# EAGLE design LED Cube (EAGLE 6.4)
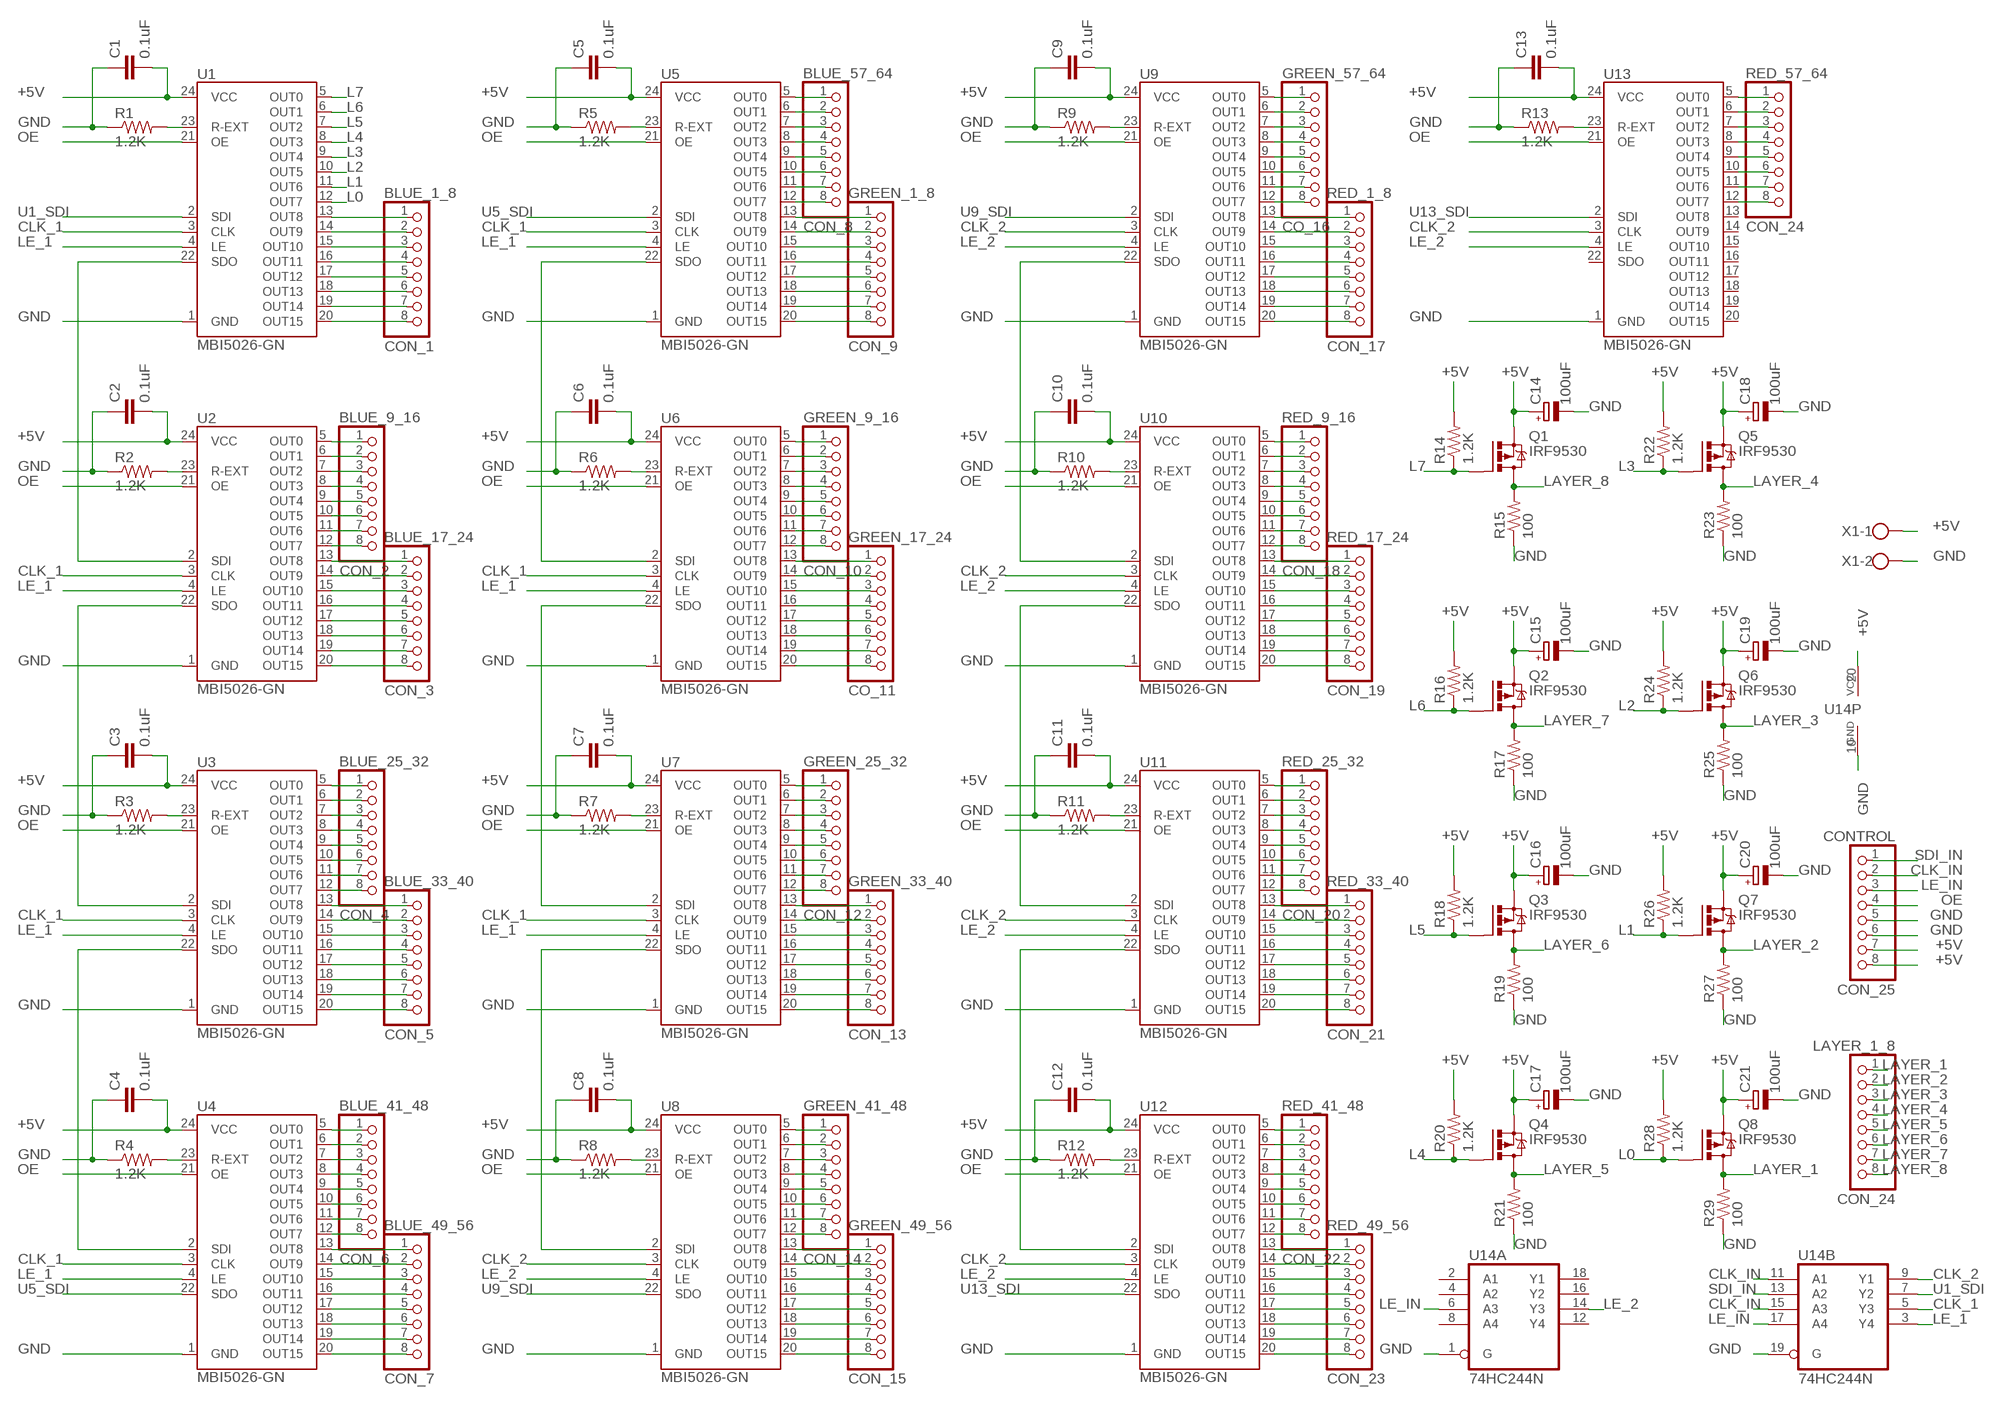
[diagram p0: schematic, sheet 1]

## Parts
BLUE_1_8  CON_1  PINHD-1X8BIG  [1X08-BIG]
BLUE_9_16  CON_2  PINHD-1X8BIG  [1X08-BIG]
BLUE_17_24  CON_3  PINHD-1X8BIG  [1X08-BIG]
BLUE_25_32  CON_4  PINHD-1X8BIG  [1X08-BIG]
BLUE_33_40  CON_5  PINHD-1X8BIG  [1X08-BIG]
BLUE_41_48  CON_6  PINHD-1X8BIG  [1X08-BIG]
BLUE_49_56  CON_7  PINHD-1X8BIG  [1X08-BIG]
BLUE_57_64  CON_8  PINHD-1X8BIG  [1X08-BIG]
C1  0.1uF  C2,5-3  [C2.5-3]
C2  0.1uF  C2,5-3  [C2.5-3]
C3  0.1uF  C2,5-3  [C2.5-3]
C4  0.1uF  C2,5-3  [C2.5-3]
C5  0.1uF  C2,5-3  [C2.5-3]
C6  0.1uF  C2,5-3  [C2.5-3]
C7  0.1uF  C2,5-3  [C2.5-3]
C8  0.1uF  C2,5-3  [C2.5-3]
C9  0.1uF  C2,5-3  [C2.5-3]
C10  0.1uF  C2,5-3  [C2.5-3]
C11  0.1uF  C2,5-3  [C2.5-3]
C12  0.1uF  C2,5-3  [C2.5-3]
C13  0.1uF  C2,5-3  [C2.5-3]
C14  100uF  CPOL-EUE5-6  [E5-6]
C15  100uF  CPOL-EUE5-6  [E5-6]
C16  100uF  CPOL-EUE5-6  [E5-6]
C17  100uF  CPOL-EUE5-6  [E5-6]
C18  100uF  CPOL-EUE5-6  [E5-6]
C19  100uF  CPOL-EUE5-6  [E5-6]
C20  100uF  CPOL-EUE5-6  [E5-6]
C21  100uF  CPOL-EUE5-6  [E5-6]
CONTROL  CON_25  PINHD-1X8BIG  [1X08-BIG]
GREEN_1_8  CON_9  PINHD-1X8BIG  [1X08-BIG]
GREEN_9_16  CON_10  PINHD-1X8BIG  [1X08-BIG]
GREEN_17_24  CO_11  PINHD-1X8BIG  [1X08-BIG]
GREEN_25_32  CON_12  PINHD-1X8BIG  [1X08-BIG]
GREEN_33_40  CON_13  PINHD-1X8BIG  [1X08-BIG]
GREEN_41_48  CON_14  PINHD-1X8BIG  [1X08-BIG]
GREEN_49_56  CON_15  PINHD-1X8BIG  [1X08-BIG]
GREEN_57_64  CO_16  PINHD-1X8BIG  [1X08-BIG]
LAYER_1_8  CON_24  PINHD-1X8BIG  [1X08-BIG]
Q1  IRF9530  [TO220BV]
Q2  IRF9530  [TO220BV]
Q3  IRF9530  [TO220BV]
Q4  IRF9530  [TO220BV]
Q5  IRF9530  [TO220BV]
Q6  IRF9530  [TO220BV]
Q7  IRF9530  [TO220BV]
Q8  IRF9530  [TO220BV]
R1  1.2K  R-US_0207/15  [0207/15]
R2  1.2K  R-US_0207/15  [0207/15]
R3  1.2K  R-US_0207/15  [0207/15]
R4  1.2K  R-US_0207/15  [0207/15]
R5  1.2K  R-US_0207/15  [0207/15]
R6  1.2K  R-US_0207/15  [0207/15]
R7  1.2K  R-US_0207/15  [0207/15]
R8  1.2K  R-US_0207/15  [0207/15]
R9  1.2K  R-US_0207/15  [0207/15]
R10  1.2K  R-US_0207/15  [0207/15]
R11  1.2K  R-US_0207/15  [0207/15]
R12  1.2K  R-US_0207/15  [0207/15]
R13  1.2K  R-US_0207/15  [0207/15]
R14  1.2K  R-US_0207/15  [0207/15]
R15  100  R-US_0207/15  [0207/15]
R16  1.2K  R-US_0207/15  [0207/15]
R17  100  R-US_0207/15  [0207/15]
R18  1.2K  R-US_0207/15  [0207/15]
R19  100  R-US_0207/15  [0207/15]
R20  1.2K  R-US_0207/15  [0207/15]
R21  100  R-US_0207/15  [0207/15]
R22  1.2K  R-US_0207/15  [0207/15]
R23  100  R-US_0207/15  [0207/15]
R24  1.2K  R-US_0207/15  [0207/15]
R25  100  R-US_0207/15  [0207/15]
R26  1.2K  R-US_0207/15  [0207/15]
R27  100  R-US_0207/15  [0207/15]
R28  1.2K  R-US_0207/15  [0207/15]
R29  100  R-US_0207/15  [0207/15]
RED_1_8  CON_17  PINHD-1X8BIG  [1X08-BIG]
RED_9_16  CON_18  PINHD-1X8BIG  [1X08-BIG]
RED_17_24  CON_19  PINHD-1X8BIG  [1X08-BIG]
RED_25_32  CON_20  PINHD-1X8BIG  [1X08-BIG]
RED_33_40  CON_21  PINHD-1X8BIG  [1X08-BIG]
RED_41_48  CON_22  PINHD-1X8BIG  [1X08-BIG]
RED_49_56  CON_23  PINHD-1X8BIG  [1X08-BIG]
RED_57_64  CON_24  PINHD-1X8BIG  [1X08-BIG]
U1  MBI5026-GN  [DIL24-3]
U2  MBI5026-GN  [DIL24-3]
U3  MBI5026-GN  [DIL24-3]
U4  MBI5026-GN  [DIL24-3]
U5  MBI5026-GN  [DIL24-3]
U6  MBI5026-GN  [DIL24-3]
U7  MBI5026-GN  [DIL24-3]
U8  MBI5026-GN  [DIL24-3]
U9  MBI5026-GN  [DIL24-3]
U10  MBI5026-GN  [DIL24-3]
U11  MBI5026-GN  [DIL24-3]
U12  MBI5026-GN  [DIL24-3]
U13  MBI5026-GN  [DIL24-3]
U14  74HC244N  [DIL20]
X1  W237-102  [W237-102]

## Nets
+5V: C1.2 C2.2 C3.2 C4.2 C5.2 C6.2 C7.2 C8.2 C9.2 C10.2 C11.2 C12.2 C13.2 C14.+ C15.+ C16.+ C17.+ C18.+ C19.+ C20.+ C21.+ CONTROL.7 CONTROL.8 Q1.S Q2.S Q3.S Q4.S Q5.S Q6.S Q7.S Q8.S R14.2 R16.2 R18.2 R20.2 R22.2 R24.2 R26.2 R28.2 U1.24(VCC) U2.24(VCC) U3.24(VCC) U4.24(VCC) U5.24(VCC) U6.24(VCC) U7.24(VCC) U8.24(VCC) U9.24(VCC) U10.24(VCC) U11.24(VCC) U12.24(VCC) U13.24(VCC) U14.20(P:VCC) X1.1
CLK_1: U1.3(CLK) U2.3(CLK) U3.3(CLK) U4.3(CLK) U5.3(CLK) U6.3(CLK) U7.3(CLK) U14.5(B:Y3)
CLK_2: U8.3(CLK) U9.3(CLK) U10.3(CLK) U11.3(CLK) U12.3(CLK) U13.3(CLK) U14.9(B:Y1)
CLK_IN: CONTROL.2 U14.11(B:A1) U14.15(B:A3)
GND: C1.1 C2.1 C3.1 C4.1 C5.1 C6.1 C7.1 C8.1 C9.1 C10.1 C11.1 C12.1 C13.1 C14.- C15.- C16.- C17.- C18.- C19.- C20.- C21.- CONTROL.5 CONTROL.6 R1.1 R2.1 R3.1 R4.1 R5.1 R6.1 R7.1 R8.1 R9.1 R10.1 R11.1 R12.1 R13.1 R15.1 R17.1 R19.1 R21.1 R23.1 R25.1 R27.1 R29.1 U1.1(GND) U2.1(GND) U3.1(GND) U4.1(GND) U5.1(GND) U6.1(GND) U7.1(GND) U8.1(GND) U9.1(GND) U10.1(GND) U11.1(GND) U12.1(GND) U13.1(GND) U14.1(A:G) U14.10(P:GND) U14.19(B:G) X1.2
L0: Q8.G R28.1 U1.12(OUT7)
L1: Q7.G R26.1 U1.11(OUT6)
L2: Q6.G R24.1 U1.10(OUT5)
L3: Q5.G R22.1 U1.9(OUT4)
L4: Q4.G R20.1 U1.8(OUT3)
L5: Q3.G R18.1 U1.7(OUT2)
L6: Q2.G R16.1 U1.6(OUT1)
L7: Q1.G R14.1 U1.5(OUT0)
LAYER_1: LAYER_1_8.1 Q8.D R29.2
LAYER_2: LAYER_1_8.2 Q7.D R27.2
LAYER_3: LAYER_1_8.3 Q6.D R25.2
LAYER_4: LAYER_1_8.4 Q5.D R23.2
LAYER_5: LAYER_1_8.5 Q4.D R21.2
LAYER_6: LAYER_1_8.6 Q3.D R19.2
LAYER_7: LAYER_1_8.7 Q2.D R17.2
LAYER_8: LAYER_1_8.8 Q1.D R15.2
LE_1: U1.4(LE) U2.4(LE) U3.4(LE) U4.4(LE) U5.4(LE) U6.4(LE) U7.4(LE) U14.3(B:Y4)
LE_2: U8.4(LE) U9.4(LE) U10.4(LE) U11.4(LE) U12.4(LE) U13.4(LE) U14.14(A:Y3)
LE_IN: CONTROL.3 U14.6(A:A3) U14.17(B:A4)
N$1: U1.22(SDO) U2.2(SDI)
N$2: BLUE_1_8.1 U1.13(OUT8)
N$3: BLUE_1_8.2 U1.14(OUT9)
N$4: BLUE_1_8.3 U1.15(OUT10)
N$5: R2.2 U2.23(R-EXT)
N$6: U2.22(SDO) U3.2(SDI)
N$7: BLUE_1_8.4 U1.16(OUT11)
N$8: BLUE_1_8.5 U1.17(OUT12)
N$9: BLUE_1_8.6 U1.18(OUT13)
N$10: R3.2 U3.23(R-EXT)
N$11: U3.22(SDO) U4.2(SDI)
N$12: BLUE_1_8.7 U1.19(OUT14)
N$13: BLUE_1_8.8 U1.20(OUT15)
N$14: R4.2 U4.23(R-EXT)
N$15: BLUE_9_16.1 U2.5(OUT0)
N$16: BLUE_9_16.2 U2.6(OUT1)
N$17: BLUE_9_16.3 U2.7(OUT2)
N$18: R1.2 U1.23(R-EXT)
N$19: BLUE_9_16.4 U2.8(OUT3)
N$20: BLUE_9_16.5 U2.9(OUT4)
N$21: R5.2 U5.23(R-EXT)
N$22: U5.22(SDO) U6.2(SDI)
N$23: BLUE_9_16.6 U2.10(OUT5)
N$24: BLUE_9_16.7 U2.11(OUT6)
N$25: R6.2 U6.23(R-EXT)
N$26: U6.22(SDO) U7.2(SDI)
N$27: BLUE_9_16.8 U2.12(OUT7)
N$28: BLUE_17_24.1 U2.13(OUT8)
N$29: BLUE_17_24.2 U2.14(OUT9)
N$30: BLUE_17_24.3 U2.15(OUT10)
N$31: R7.2 U7.23(R-EXT)
N$32: U7.22(SDO) U8.2(SDI)
N$33: BLUE_17_24.4 U2.16(OUT11)
N$34: BLUE_17_24.5 U2.17(OUT12)
N$35: R8.2 U8.23(R-EXT)
N$36: BLUE_17_24.6 U2.18(OUT13)
N$37: BLUE_17_24.7 U2.19(OUT14)
N$38: BLUE_17_24.8 U2.20(OUT15)
N$39: BLUE_25_32.1 U3.5(OUT0)
N$40: BLUE_25_32.2 U3.6(OUT1)
N$41: R9.2 U9.23(R-EXT)
N$42: U9.22(SDO) U10.2(SDI)
N$43: BLUE_25_32.3 U3.7(OUT2)
N$44: BLUE_25_32.4 U3.8(OUT3)
N$45: R10.2 U10.23(R-EXT)
N$46: U10.22(SDO) U11.2(SDI)
N$47: BLUE_25_32.5 U3.9(OUT4)
N$48: BLUE_25_32.6 U3.10(OUT5)
N$49: BLUE_25_32.7 U3.11(OUT6)
N$50: BLUE_25_32.8 U3.12(OUT7)
N$51: R11.2 U11.23(R-EXT)
N$52: U11.22(SDO) U12.2(SDI)
N$53: BLUE_33_40.1 U3.13(OUT8)
N$54: BLUE_33_40.2 U3.14(OUT9)
N$55: R12.2 U12.23(R-EXT)
N$56: BLUE_33_40.3 U3.15(OUT10)
N$57: BLUE_33_40.4 U3.16(OUT11)
N$58: BLUE_33_40.5 U3.17(OUT12)
N$59: BLUE_33_40.6 U3.18(OUT13)
N$60: BLUE_33_40.7 U3.19(OUT14)
N$61: BLUE_33_40.8 U3.20(OUT15)
N$62: R13.2 U13.23(R-EXT)
N$63: BLUE_41_48.1 U4.5(OUT0)
N$64: BLUE_41_48.2 U4.6(OUT1)
N$65: BLUE_41_48.3 U4.7(OUT2)
N$66: BLUE_41_48.4 U4.8(OUT3)
N$67: BLUE_41_48.5 U4.9(OUT4)
N$68: BLUE_41_48.6 U4.10(OUT5)
N$69: BLUE_41_48.7 U4.11(OUT6)
N$70: BLUE_41_48.8 U4.12(OUT7)
N$71: BLUE_49_56.1 U4.13(OUT8)
N$72: BLUE_49_56.2 U4.14(OUT9)
N$73: BLUE_49_56.3 U4.15(OUT10)
N$74: BLUE_49_56.4 U4.16(OUT11)
N$75: BLUE_49_56.5 U4.17(OUT12)
N$76: BLUE_49_56.6 U4.18(OUT13)
N$77: BLUE_49_56.7 U4.19(OUT14)
N$78: BLUE_49_56.8 U4.20(OUT15)
N$79: BLUE_57_64.1 U5.5(OUT0)
N$80: BLUE_57_64.2 U5.6(OUT1)
N$81: BLUE_57_64.3 U5.7(OUT2)
N$82: BLUE_57_64.4 U5.8(OUT3)
N$83: BLUE_57_64.5 U5.9(OUT4)
N$84: BLUE_57_64.6 U5.10(OUT5)
N$85: BLUE_57_64.7 U5.11(OUT6)
N$86: BLUE_57_64.8 U5.12(OUT7)
N$87: GREEN_1_8.1 U5.13(OUT8)
N$88: GREEN_1_8.2 U5.14(OUT9)
N$89: GREEN_1_8.3 U5.15(OUT10)
N$90: GREEN_1_8.4 U5.16(OUT11)
N$91: GREEN_1_8.5 U5.17(OUT12)
N$92: GREEN_1_8.6 U5.18(OUT13)
N$93: GREEN_1_8.7 U5.19(OUT14)
N$94: GREEN_1_8.8 U5.20(OUT15)
N$95: GREEN_9_16.1 U6.5(OUT0)
N$96: GREEN_9_16.2 U6.6(OUT1)
N$97: GREEN_9_16.3 U6.7(OUT2)
N$98: GREEN_9_16.4 U6.8(OUT3)
N$99: GREEN_9_16.5 U6.9(OUT4)
N$100: GREEN_9_16.6 U6.10(OUT5)
N$101: GREEN_9_16.7 U6.11(OUT6)
N$102: GREEN_9_16.8 U6.12(OUT7)
N$103: GREEN_17_24.1 U6.13(OUT8)
N$104: GREEN_17_24.2 U6.14(OUT9)
N$105: GREEN_17_24.3 U6.15(OUT10)
N$106: GREEN_17_24.4 U6.16(OUT11)
N$107: GREEN_17_24.5 U6.17(OUT12)
N$108: GREEN_17_24.6 U6.18(OUT13)
N$109: GREEN_17_24.7 U6.19(OUT14)
N$110: GREEN_17_24.8 U6.20(OUT15)
N$111: GREEN_25_32.1 U7.5(OUT0)
N$112: GREEN_25_32.2 U7.6(OUT1)
N$113: GREEN_25_32.3 U7.7(OUT2)
N$114: GREEN_25_32.4 U7.8(OUT3)
N$115: GREEN_25_32.5 U7.9(OUT4)
N$116: GREEN_25_32.6 U7.10(OUT5)
N$117: GREEN_25_32.7 U7.11(OUT6)
N$118: GREEN_25_32.8 U7.12(OUT7)
N$119: GREEN_33_40.1 U7.13(OUT8)
N$120: GREEN_33_40.2 U7.14(OUT9)
N$121: GREEN_33_40.3 U7.15(OUT10)
N$122: GREEN_33_40.4 U7.16(OUT11)
N$123: GREEN_33_40.5 U7.17(OUT12)
N$124: GREEN_33_40.6 U7.18(OUT13)
N$125: GREEN_33_40.7 U7.19(OUT14)
N$126: GREEN_33_40.8 U7.20(OUT15)
N$127: GREEN_41_48.1 U8.5(OUT0)
N$128: GREEN_41_48.2 U8.6(OUT1)
N$129: GREEN_41_48.3 U8.7(OUT2)
N$130: GREEN_41_48.4 U8.8(OUT3)
N$131: GREEN_41_48.5 U8.9(OUT4)
N$132: GREEN_41_48.6 U8.10(OUT5)
N$133: GREEN_41_48.7 U8.11(OUT6)
N$134: GREEN_41_48.8 U8.12(OUT7)
N$135: GREEN_49_56.1 U8.13(OUT8)
N$136: GREEN_49_56.2 U8.14(OUT9)
N$137: GREEN_49_56.3 U8.15(OUT10)
N$138: GREEN_49_56.4 U8.16(OUT11)
N$139: GREEN_49_56.5 U8.17(OUT12)
N$140: GREEN_49_56.6 U8.18(OUT13)
N$141: GREEN_49_56.7 U8.19(OUT14)
N$142: GREEN_49_56.8 U8.20(OUT15)
N$143: GREEN_57_64.1 U9.5(OUT0)
N$144: GREEN_57_64.2 U9.6(OUT1)
N$145: GREEN_57_64.3 U9.7(OUT2)
N$146: GREEN_57_64.4 U9.8(OUT3)
N$147: GREEN_57_64.5 U9.9(OUT4)
N$148: GREEN_57_64.6 U9.10(OUT5)
N$149: GREEN_57_64.7 U9.11(OUT6)
N$150: GREEN_57_64.8 U9.12(OUT7)
N$151: RED_1_8.1 U9.13(OUT8)
N$152: RED_1_8.2 U9.14(OUT9)
N$153: RED_1_8.3 U9.15(OUT10)
N$154: RED_1_8.4 U9.16(OUT11)
N$155: RED_1_8.5 U9.17(OUT12)
N$156: RED_1_8.6 U9.18(OUT13)
N$157: RED_1_8.7 U9.19(OUT14)
N$158: RED_1_8.8 U9.20(OUT15)
N$159: RED_9_16.1 U10.5(OUT0)
N$160: RED_9_16.2 U10.6(OUT1)
N$161: RED_9_16.3 U10.7(OUT2)
N$162: RED_9_16.4 U10.8(OUT3)
N$163: RED_9_16.5 U10.9(OUT4)
N$164: RED_9_16.6 U10.10(OUT5)
N$165: RED_9_16.7 U10.11(OUT6)
N$166: RED_9_16.8 U10.12(OUT7)
N$167: RED_17_24.1 U10.13(OUT8)
N$168: RED_17_24.2 U10.14(OUT9)
N$169: RED_17_24.3 U10.15(OUT10)
N$170: RED_17_24.4 U10.16(OUT11)
N$171: RED_17_24.5 U10.17(OUT12)
N$172: RED_17_24.6 U10.18(OUT13)
N$173: RED_17_24.7 U10.19(OUT14)
N$174: RED_17_24.8 U10.20(OUT15)
N$175: RED_25_32.1 U11.5(OUT0)
N$176: RED_25_32.2 U11.6(OUT1)
N$177: RED_25_32.3 U11.7(OUT2)
N$178: RED_25_32.4 U11.8(OUT3)
N$179: RED_25_32.5 U11.9(OUT4)
N$180: RED_25_32.6 U11.10(OUT5)
N$181: RED_25_32.7 U11.11(OUT6)
N$182: RED_25_32.8 U11.12(OUT7)
N$183: RED_33_40.1 U11.13(OUT8)
N$184: RED_33_40.2 U11.14(OUT9)
N$185: RED_33_40.3 U11.15(OUT10)
N$186: RED_33_40.4 U11.16(OUT11)
N$187: RED_33_40.5 U11.17(OUT12)
N$188: RED_33_40.6 U11.18(OUT13)
N$189: RED_33_40.7 U11.19(OUT14)
N$190: RED_33_40.8 U11.20(OUT15)
N$191: RED_41_48.1 U12.5(OUT0)
N$192: RED_41_48.2 U12.6(OUT1)
N$193: RED_41_48.3 U12.7(OUT2)
N$194: RED_41_48.4 U12.8(OUT3)
N$195: RED_41_48.5 U12.9(OUT4)
N$196: RED_41_48.6 U12.10(OUT5)
N$197: RED_41_48.7 U12.11(OUT6)
N$198: RED_41_48.8 U12.12(OUT7)
N$199: RED_49_56.1 U12.13(OUT8)
N$200: RED_49_56.2 U12.14(OUT9)
N$201: RED_49_56.3 U12.15(OUT10)
N$202: RED_49_56.4 U12.16(OUT11)
N$203: RED_49_56.5 U12.17(OUT12)
N$204: RED_49_56.6 U12.18(OUT13)
N$205: RED_49_56.7 U12.19(OUT14)
N$206: RED_49_56.8 U12.20(OUT15)
N$207: RED_57_64.1 U13.5(OUT0)
N$208: RED_57_64.2 U13.6(OUT1)
N$209: RED_57_64.3 U13.7(OUT2)
N$210: RED_57_64.4 U13.8(OUT3)
N$211: RED_57_64.5 U13.9(OUT4)
N$212: RED_57_64.6 U13.10(OUT5)
N$213: RED_57_64.7 U13.11(OUT6)
N$214: RED_57_64.8 U13.12(OUT7)
OE: CONTROL.4 U1.21(OE) U2.21(OE) U3.21(OE) U4.21(OE) U5.21(OE) U6.21(OE) U7.21(OE) U8.21(OE) U9.21(OE) U10.21(OE) U11.21(OE) U12.21(OE) U13.21(OE)
SDI_IN: CONTROL.1 U14.13(B:A2)
U1_SDI: U1.2(SDI) U14.7(B:Y2)
U5_SDI: U4.22(SDO) U5.2(SDI)
U9_SDI: U8.22(SDO) U9.2(SDI)
U13_SDI: U12.22(SDO) U13.2(SDI)
Unconnected: U13.13(OUT8) U13.14(OUT9) U13.15(OUT10) U13.16(OUT11) U13.17(OUT12) U13.18(OUT13) U13.19(OUT14) U13.20(OUT15) U13.22(SDO) U14.2(A:A1) U14.4(A:A2) U14.8(A:A4) U14.12(A:Y4) U14.16(A:Y2) U14.18(A:Y1)

## Library data of the parts
BLUE_1_8 BLUE_9_16 BLUE_17_24 BLUE_25_32 BLUE_33_40 BLUE_41_48 BLUE_49_56 BLUE_57_64 CONTROL GREEN_1_8 GREEN_9_16 GREEN_17_24 GREEN_25_32 GREEN_33_40 GREEN_41_48 GREEN_49_56 GREEN_57_64 LAYER_1_8 RED_1_8 RED_9_16 RED_17_24 RED_25_32 RED_33_40 RED_41_48 RED_49_56 RED_57_64 = adafruit:PINHD-1X8: PIN HEADER
C1-C13 = capacitor-wima:C: CAPACITOR naming: grid - package width
C14-C21 = rcl:CPOL-EU: POLARIZED CAPACITOR, European symbol
Q1-Q8 = transistor-power:IRF9530: P-CHANNEL HEXFET POWER-MOS-FET Source: http://www.irf.com/product-info/datasheets/data/irf9530.pdf
R1-R29 = adafruit:R-US_: RESISTOR, American symbol
U1-U13 = XYKlib:MBI5026: MBI5026 16-bit Constant Current LED Sink Driver The MBI5026 is a 16-channel, constant-current sink LED driver.
U14 = 74xx-eu:74*244: Octal BUFFER and LINE DRIVER, 3-state
X1 = con-wago-500:W237-102: WAGO SCREW CLAMP; MPN: 237-102; OC_FARNELL: unknown; OC_NEWARK: 70K9898

## Board
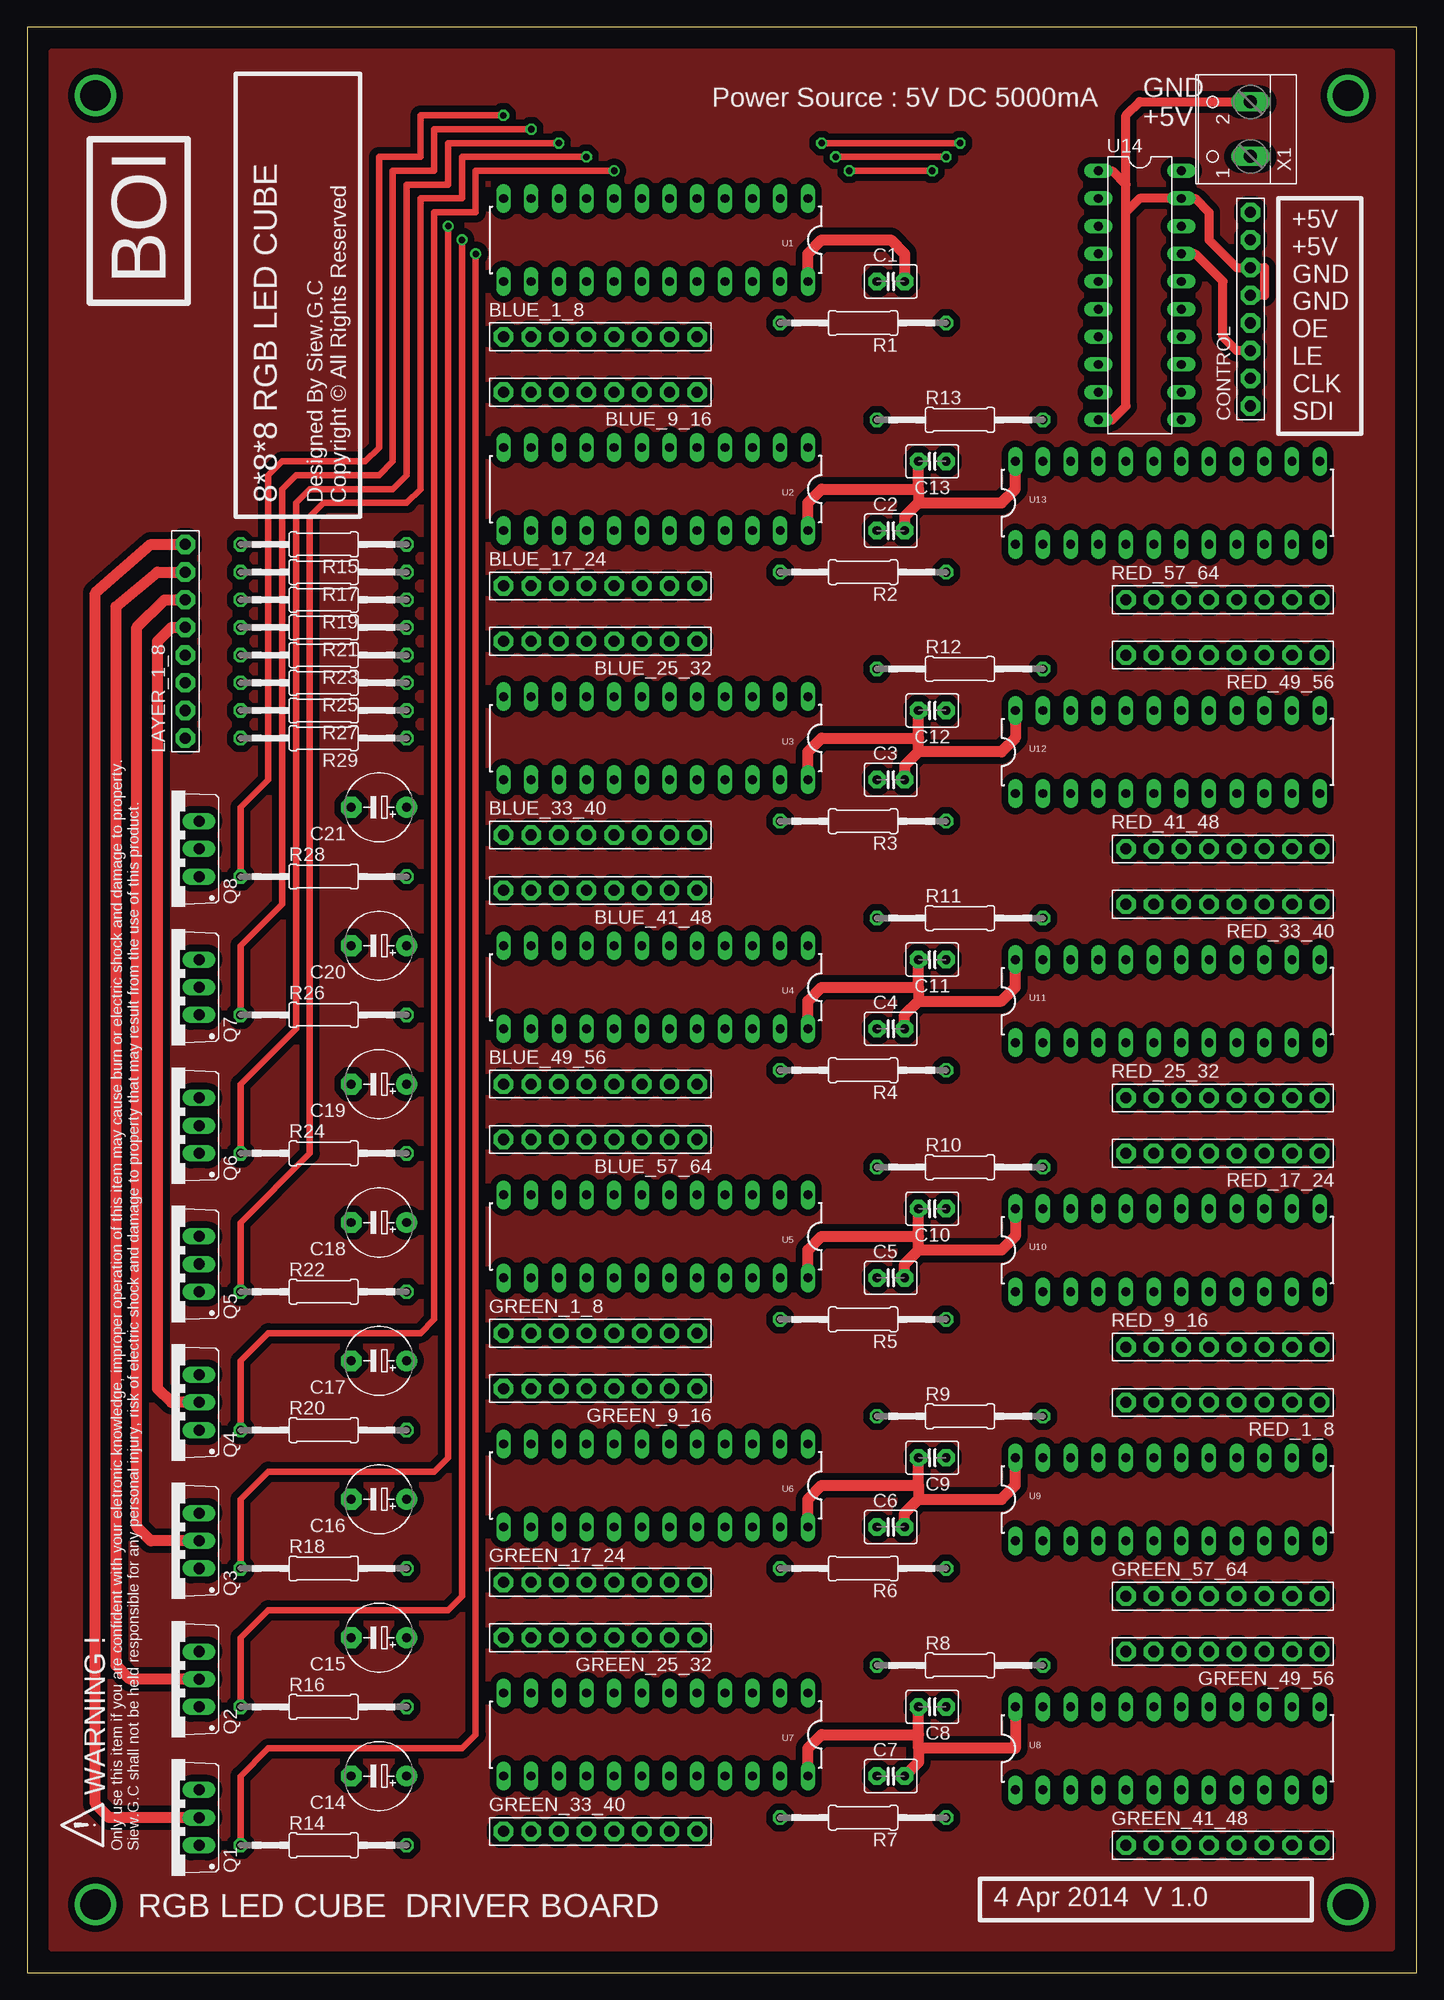
[diagram p1: board, top side]
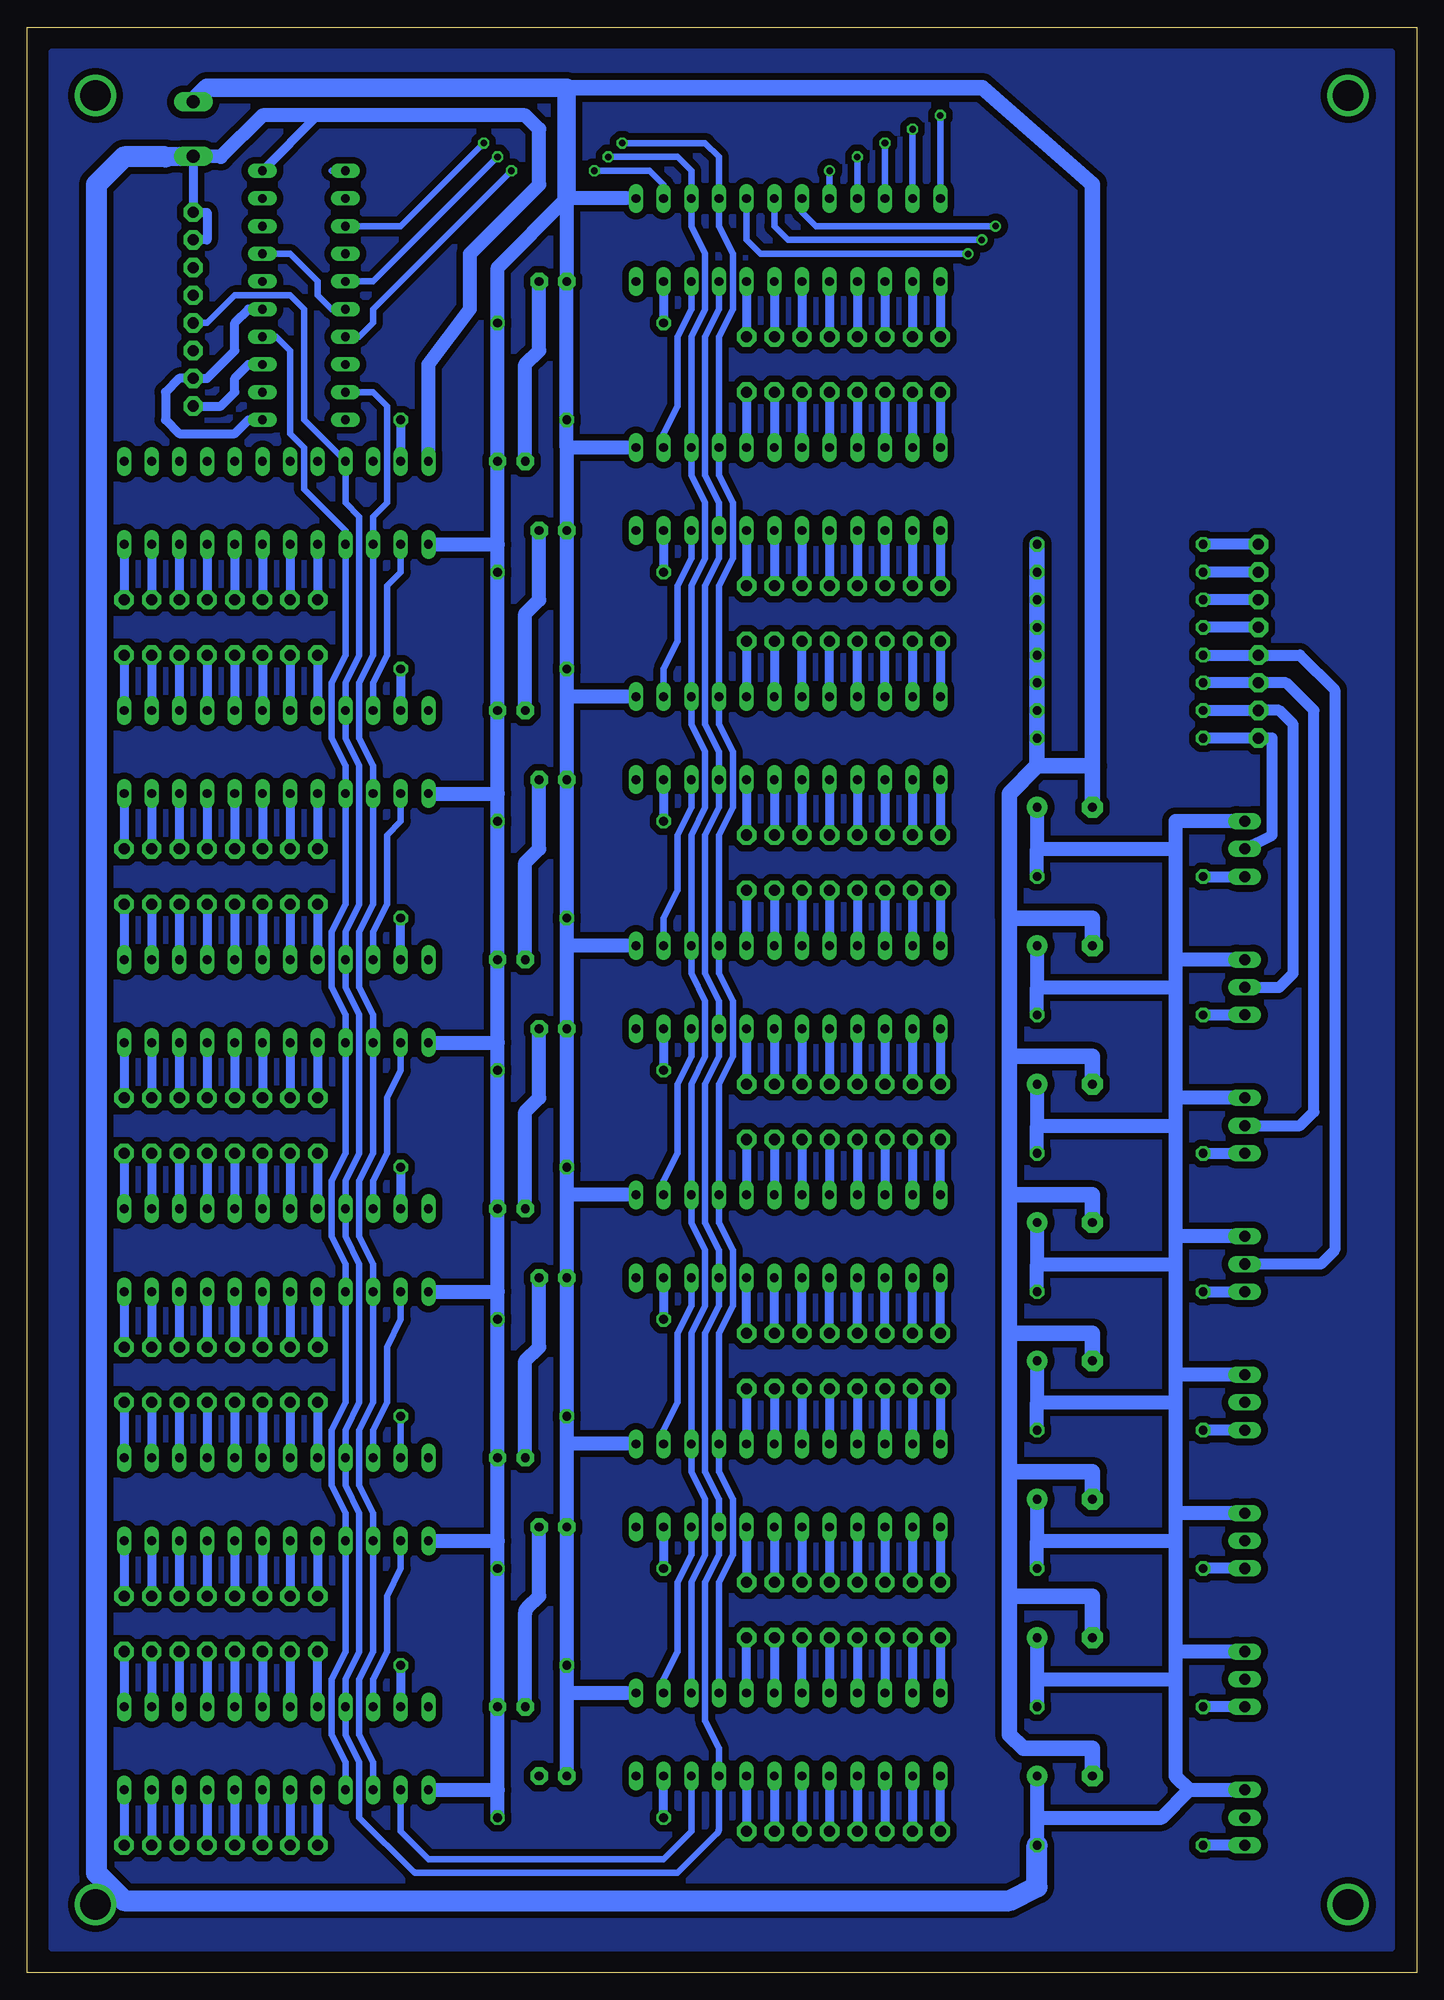
[diagram p2: board, bottom side, seen from below]

Size 127.54 x 178.54 mm. Coordinates in mm from the lower left corner, seen from the top.
Outline: 0,0 127.54,0 127.54,178.54 0,178.54 0,0
Copper layers (1*16): Top 0.035mm / dielectric 1.5mm / Bottom 0.035mm
Design rules "default *": minimum track width 6mil, minimum drill 24mil, track to track 12mil, track to pad 8mil, pad to pad 8mil, via to via 8mil, smd to smd 8mil, copper to edge 40mil, drill to drill 4mil, minimum pad ring 10mil, minimum via ring 8mil, stop-mask expansion 4mil, vias tented up to drill 0mil, thermal gap 10mil

### Footprints (pad centres in the part's own frame; a part is rotated, then mirrored left to right if it is on the bottom)
1X08-BIG = drill 1.016 pad 1.778 octagon: 1 -8.89,0; 2 -6.35,0; 3 -3.81,0; 4 -1.27,0; 5 1.27,0; 6 3.81,0; 7 6.35,0; 8 8.89,0
C2.5-3 = drill 0.813 pad 1.6 octagon: 1 -1.27,0; 2 1.27,0
E5-6 = drill 0.813 pad 1.905: + -2.54,0 | drill 0.813 pad 1.905 octagon: - 2.54,0
TO220BV = drill 1.016 long: D 0,-2.54; G -2.54,-2.54; S 2.54,-2.54
0207/15 = drill 0.813 octagon: 1 -7.62,0; 2 7.62,0
DIL24-3 = drill 0.813 long: 1 -16.51,-3.81; 2 -13.97,-3.81; 3 -11.43,-3.81; 4 -8.89,-3.81; 5 -6.35,-3.81; 6 -3.81,-3.81; 7 -1.27,-3.81; 8 1.27,-3.81; 9 3.81,-3.81; 10 6.35,-3.81; 11 8.89,-3.81; 12 11.43,-3.81; 13 11.43,3.81; 14 8.89,3.81; 15 6.35,3.81; 16 3.81,3.81; 17 1.27,3.81; 18 -1.27,3.81; 19 -3.81,3.81; 20 -6.35,3.81; 21 -8.89,3.81; 22 -11.43,3.81; 23 -13.97,3.81; 24 -16.51,3.81
DIL20 = drill 0.813 long: 1 -11.43,-3.81; 2 -8.89,-3.81; 3 -6.35,-3.81; 4 -3.81,-3.81; 5 -1.27,-3.81; 6 1.27,-3.81; 7 3.81,-3.81; 8 6.35,-3.81; 9 8.89,-3.81; 10 11.43,-3.81; 11 11.43,3.81; 12 8.89,3.81; 13 6.35,3.81; 14 3.81,3.81; 15 1.27,3.81; 16 -1.27,3.81; 17 -3.81,3.81; 18 -6.35,3.81; 19 -8.89,3.81; 20 -11.43,3.81
W237-102 = drill 1.194 long: 1 -2.5,-1.27; 2 2.5,-1.27

### Placement (x,y rotation side)
BLUE_1_8  52.61,150.13 0 top
BLUE_9_16  52.61,145.05 180 top
BLUE_17_24  52.61,127.27 0 top
BLUE_25_32  52.61,122.19 180 top
BLUE_33_40  52.61,104.41 0 top
BLUE_41_48  52.61,99.33 180 top
BLUE_49_56  52.61,81.55 0 top
BLUE_57_64  52.61,76.47 180 top
C1  79.28,155.21 0 top
C2  79.28,132.35 0 top
C3  79.28,109.49 0 top
C4  79.28,86.63 0 top
C5  79.28,63.77 0 top
C6  79.28,40.91 0 top
C7  79.28,18.05 0 top
C8  83.09,24.4 180 top
C9  83.09,47.26 180 top
C10  83.09,70.12 180 top
C11  83.09,92.98 180 top
C12  83.09,115.84 180 top
C13  83.09,138.7 180 top
C14  32.29,18.05 180 top
C15  32.29,30.75 180 top
C16  32.29,43.45 180 top
C17  32.29,56.15 180 top
C18  32.29,68.85 180 top
C19  32.29,81.55 180 top
C20  32.29,94.25 180 top
C21  32.29,106.95 180 top
CONTROL  112.3,152.67 90 top
GREEN_1_8  52.61,58.69 0 top
GREEN_9_16  52.61,53.61 180 top
GREEN_17_24  52.61,35.83 0 top
GREEN_25_32  52.61,30.75 180 top
GREEN_33_40  52.61,12.97 0 top
GREEN_41_48  109.76,11.7 0 top
GREEN_49_56  109.76,29.48 180 top
GREEN_57_64  109.76,34.56 0 top
LAYER_1_8  14.51,122.19 90 top
Q1  13.24,14.24 90 top
Q2  13.24,26.94 90 top
Q3  13.24,39.64 90 top
Q4  13.24,52.34 90 top
Q5  13.24,65.04 90 top
Q6  13.24,77.74 90 top
Q7  13.24,90.44 90 top
Q8  13.24,103.14 90 top
R1  76.74,151.4 180 top
R2  76.74,128.54 180 top
R3  76.74,105.68 180 top
R4  76.74,82.82 180 top
R5  76.74,59.96 180 top
R6  76.74,37.1 180 top
R7  76.74,14.24 180 top
R8  85.63,28.21 0 top
R9  85.63,51.07 0 top
R10  85.63,73.93 0 top
R11  85.63,96.79 0 top
R12  85.63,119.65 0 top
R13  85.63,142.51 0 top
R14  27.21,11.7 0 top
R15  27.21,131.08 180 top
R16  27.21,24.4 0 top
R17  27.21,128.54 180 top
R18  27.21,37.1 0 top
R19  27.21,126 180 top
R20  27.21,49.8 0 top
R21  27.21,123.46 180 top
R22  27.21,62.5 0 top
R23  27.21,120.92 180 top
R24  27.21,75.2 0 top
R25  27.21,118.38 180 top
R26  27.21,87.9 0 top
R27  27.21,115.84 180 top
R28  27.21,100.6 0 top
R29  27.21,113.3 180 top
RED_1_8  109.76,52.34 180 top
RED_9_16  109.76,57.42 0 top
RED_17_24  109.76,75.2 180 top
RED_25_32  109.76,80.28 0 top
RED_33_40  109.76,98.06 180 top
RED_41_48  109.76,103.14 0 top
RED_49_56  109.76,120.92 180 top
RED_57_64  109.76,126 0 top
U1  55.15,159.02 180 top
U2  55.15,136.16 180 top
U3  55.15,113.3 180 top
U4  55.15,90.44 180 top
U5  55.15,67.58 180 top
U6  55.15,44.72 180 top
U7  55.15,21.86 180 top
U8  107.22,20.59 0 top
U9  107.22,43.45 0 top
U10  107.22,66.31 0 top
U11  107.22,89.17 0 top
U12  107.22,112.03 0 top
U13  107.22,134.89 0 top
U14  102.14,153.94 270 top
X1  111.03,169.18 90 top

### Tracks (layer width: path | path; a pad name or v marks a point on that pad's centre or on a via)
+5V
  Top 1.016: U7.24 71.66,20.59 72.93,21.86 81.82,21.86 | U8.24 90.71,20.59 81.82,20.59 | 81.82,20.59 81.82,21.86 | 81.82,21.86 C8.2 | 81.82,20.59 81.82,19.32 C7.2 | U6.24 71.66,43.45 72.93,44.72 81.82,44.72 | 81.82,44.72 C9.2 | 81.82,44.72 81.82,43.45 | 81.82,43.45 89.44,43.45 90.71,44.72 U9.24 | U5.24 71.66,66.31 72.93,67.58 81.82,67.58 C10.2 81.82,66.31 | U10.24 90.71,67.58 89.44,66.31 81.82,66.31 | C5.2 80.55,65.04 81.82,66.31 | C6.2 80.55,42.18 81.82,43.45 | U3.24 71.66,112.03 72.93,113.3 81.82,113.3 | 81.82,113.3 C12.2 | U12.24 90.71,113.3 89.44,112.03 81.82,112.03 | 81.82,112.03 81.82,113.3 | 81.82,112.03 80.55,110.76 C3.2 | U4.24 71.66,89.17 72.93,90.44 81.82,90.44 | 81.82,90.44 C11.2 | 81.82,90.44 81.82,89.17 | 81.82,89.17 89.44,89.17 90.71,90.44 U11.24 | C4.2 80.55,87.9 81.82,89.17 | U2.24 71.66,134.89 72.93,136.16 81.82,136.16 | 81.82,136.16 C13.2 | 81.82,136.16 81.82,134.89 | 81.82,134.89 89.44,134.89 90.71,136.16 U13.24 | 81.82,134.89 80.55,133.62 C2.2 | U1.24 71.66,157.75 72.93,159.02 79.28,159.02 80.55,157.75 C1.2
  Bottom 0.813: X1.1 CONTROL.8 111.03,161.56 111.03,159.02 CONTROL.7 | U14.20 100.87,170.45 105.95,170.45
  Bottom 1.27: C8.2 81.82,33.03 arc45 81.63,33.48 80.55,34.56 C6.2 | C9.2 81.82,56.15 80.55,57.42 C5.2 | C10.2 81.82,79.01 80.55,80.28 C4.2 | C11.2 81.82,101.87 80.55,103.14 C3.2 | C12.2 81.82,124.73 80.55,126 C2.2 | C13.2 81.82,147.59 80.55,148.86 C1.2 | U13.24 90.71,147.59 86.9,152.67 86.9,157.75 80.55,164.1 80.55,169.18 81.82,170.45 105.95,170.45 109.76,166.64 X1.1 | Q8.S 22.13,105.68 22.13,103.14 | 22.13,103.14 22.13,92.98 | 22.13,92.98 22.13,90.44 | 22.13,90.44 22.13,80.28 | 22.13,80.28 22.13,77.74 | 22.13,77.74 22.13,67.58 | 22.13,67.58 22.13,65.04 | 22.13,65.04 22.13,54.88 | 22.13,54.88 22.13,52.34 | 22.13,52.34 22.13,42.18 | 22.13,42.18 22.13,39.64 | 22.13,39.64 22.13,29.48 | 22.13,29.48 22.13,26.94 | 22.13,26.94 22.13,18.05 20.86,16.78 | 20.86,16.78 Q1.S | Q2.S 22.13,29.48 | Q3.S 22.13,42.18 | Q4.S 22.13,54.88 | Q5.S 22.13,67.58 | Q6.S 22.13,80.28 | Q7.S 22.13,92.98 | C21.+ 34.83,103.14 | 34.83,103.14 22.13,103.14 | C20.+ 34.83,90.44 | 34.83,90.44 22.13,90.44 | C19.+ 34.83,77.74 | 34.83,77.74 22.13,77.74 | C18.+ 34.83,65.04 | 34.83,65.04 22.13,65.04 | C17.+ 34.83,52.34 | 34.83,52.34 22.13,52.34 | C16.+ 34.83,39.64 | 34.83,39.64 22.13,39.64 | C15.+ 34.83,26.94 | 34.83,26.94 22.13,26.94 | C14.+ 34.83,14.24 | 34.83,14.24 23.4,14.24 20.86,16.78 | 34.83,14.24 R14.2 | 34.83,26.94 R16.2 | R18.2 34.83,39.64 | R20.2 34.83,52.34 | R22.2 34.83,65.04 | R24.2 34.83,77.74 | R26.2 34.83,90.44 | R28.2 34.83,103.14
  Bottom 1.778: X1.1 114.84,166.64
  Bottom 1.93: 114.84,166.64 118.65,166.64 121.19,164.1 121.19,9.16 118.65,6.62 37.37,6.62 34.83,7.89 R14.2
CLK_1  (via drill 0.6)
  Top 0.61: v74.2,166.64 v84.36,166.64
  Bottom 0.61: v74.2,166.64 67.85,166.64 66.58,165.37 U1.3 66.58,160.29 65.31,157.75 65.31,152.67 66.58,150.13 U2.3 66.58,137.43 65.31,134.89 65.31,129.81 66.58,127.27 U3.3 66.58,114.57 65.31,112.03 65.31,106.95 66.58,104.41 U4.3 66.58,91.71 65.31,89.17 65.31,84.09 66.58,81.55 U5.3 66.58,68.85 65.31,66.31 65.31,61.23 66.58,58.69 U6.3 66.58,45.99 65.31,43.45 65.31,38.37 66.58,35.83 U7.3 | U14.5 95.79,155.21 v84.36,166.64
CLK_2
  Bottom 0.61: U8.3 95.79,19.32 97.06,21.86 97.06,26.94 95.79,29.48 U9.3 95.79,42.18 97.06,44.72 97.06,49.8 95.79,52.34 U10.3 95.79,65.04 97.06,67.58 97.06,72.66 95.79,75.2 U11.3 95.79,87.9 97.06,90.44 97.06,95.52 95.79,98.06 U12.3 95.79,110.76 97.06,113.3 97.06,118.38 95.79,120.92 U13.3 95.79,133.62 94.52,134.89 94.52,143.78 95.79,145.05 U14.9
CLK_IN
  Bottom 0.813: U14.15 107.22,152.67 108.49,151.4 108.49,148.86 111.03,146.32 CONTROL.2 113.57,146.32 114.84,145.05 114.84,142.51 113.57,141.24 108.49,141.24 107.22,142.51 U14.11
GND
  Top 0.61: U14.10 99.6,142.51 | 99.6,165.37 U14.1
  Top 0.813: 99.6,142.51 100.87,143.78 100.87,161.56 | 100.87,161.56 102.14,162.83 U14.19 107.22,162.83 108.49,161.56 108.49,159.02 111.03,156.48 CONTROL.6 113.57,156.48 113.57,153.94 CONTROL.5 | 100.87,161.56 100.87,164.1 | 100.87,164.1 100.87,170.45 102.14,171.72 110.99,171.72 X1.2 | 99.6,165.37 100.87,164.1
  Bottom 0.61: 99.6,165.37 U14.1
  Bottom 1.27: U2.1 78.01,139.97 | 78.01,139.97 C2.1 R12.1 78.01,117.11 | 78.01,117.11 C3.1 R11.1 78.01,94.25 | 78.01,94.25 C4.1 R10.1 78.01,71.39 | 78.01,71.39 C5.1 R9.1 78.01,48.53 | 78.01,48.53 C6.1 R8.1 78.01,25.67 | 78.01,25.67 C7.1 | 84.36,39.64 R6.1 C8.1 84.36,16.78 | 84.36,39.64 C9.1 R5.1 84.36,62.5 | 84.36,62.5 C10.1 R4.1 84.36,85.36 | 84.36,85.36 C11.1 R3.1 84.36,108.22 | 84.36,108.22 C12.1 R2.1 84.36,131.08 | 84.36,131.08 C13.1 R1.1 84.36,156.48 78.01,162.83 | U7.1 78.01,25.67 | U6.1 78.01,48.53 | U5.1 78.01,71.39 | U4.1 78.01,94.25 | 78.01,139.97 R13.1 C1.1 78.01,162.83 | U1.1 78.01,162.83 | U13.1 84.36,131.08 | U12.1 84.36,108.22 | U11.1 84.36,85.36 | U10.1 84.36,62.5 | U9.1 84.36,39.64 | R7.1 84.36,16.78 | U8.1 84.36,16.78 | U3.1 78.01,117.11
  Bottom 1.422: R15.1 R17.1 R19.1 R21.1 R23.1 R25.1 R27.1 R29.1 34.83,110.76 | C20.- 29.75,96.79 37.37,96.79 | 37.37,96.79 37.37,108.22 34.83,110.76 | 37.37,96.79 37.37,84.09 | 37.37,84.09 37.37,71.39 | 37.37,71.39 37.37,58.69 | 37.37,58.69 37.37,45.99 | 37.37,45.99 37.37,34.56 | 37.37,34.56 37.37,21.86 36.1,20.59 29.75,20.59 C14.- | C15.- 29.75,34.56 37.37,34.56 | C16.- 29.75,45.99 37.37,45.99 | C17.- 29.75,58.69 37.37,58.69 | C18.- 29.75,71.39 37.37,71.39 | C19.- 29.75,84.09 37.37,84.09 | C21.- 29.75,110.76 | 29.75,110.76 29.75,164.14 39.87,172.99 78.01,172.99 | 29.75,110.76 34.83,110.76
  Bottom 1.676: 78.01,162.83 78.01,172.99 111.03,172.99 X1.2
L0  (via drill 0.6)
  Top 0.61: R28.1 19.59,106.95 22.13,109.49 22.13,137.43 23.4,138.7 31.02,138.7 32.29,139.97 32.29,166.64 36.1,166.64 36.1,170.45 v43.72,170.45
  Bottom 0.61: v43.72,170.45 U1.12
  Bottom 1.016: R28.1 Q8.G
L1  (via drill 0.6)
  Top 0.61: R26.1 19.59,94.25 23.4,98.06 23.4,136.16 24.67,137.43 32.29,137.43 33.56,138.7 33.56,165.37 37.37,165.37 37.37,169.18 v46.26,169.18
  Bottom 0.61: v46.26,169.18 U1.11
  Bottom 1.016: R26.1 Q7.G
L2  (via drill 0.6)
  Top 0.61: R24.1 19.59,81.55 24.67,86.63 24.67,134.89 25.94,136.16 33.56,136.16 34.83,137.43 34.83,164.1 38.64,164.1 38.64,167.91 v48.8,167.91
  Bottom 0.61: v48.8,167.91 U1.10
  Bottom 1.016: R24.1 Q6.G
L3  (via drill 0.6)
  Top 0.61: R22.1 19.59,68.85 25.94,75.2 25.94,133.62 27.21,134.89 34.83,134.89 36.1,136.16 36.1,162.83 39.91,162.83 39.91,166.64 v51.34,166.64
  Bottom 0.61: v51.34,166.64 U1.9
  Bottom 1.016: R22.1 Q5.G
L4  (via drill 0.6)
  Top 0.61: R20.1 19.59,56.15 22.13,58.69 36.1,58.69 37.37,59.96 37.37,161.56 41.18,161.56 41.18,165.37 v53.88,165.37
  Bottom 0.61: v53.88,165.37 U1.8
  Bottom 1.016: Q4.G R20.1
L5  (via drill 0.6)
  Top 0.61: R18.1 19.59,43.45 22.13,45.99 37.37,45.99 38.64,47.26 v38.64,160.29
  Bottom 0.61: v38.64,160.29 55.15,160.29 56.42,161.56 U1.7
  Bottom 1.016: Q3.G R18.1
L6  (via drill 0.6)
  Top 0.61: R16.1 19.59,30.75 22.13,33.29 38.64,33.29 39.91,34.56 v39.91,159.02
  Bottom 0.61: U1.6 58.96,160.29 57.69,159.02 v39.91,159.02
  Bottom 1.016: Q2.G R16.1
L7  (via drill 0.6)
  Top 0.61: R14.1 19.59,18.05 22.13,20.59 39.91,20.59 41.18,21.86 v41.18,157.75
  Bottom 0.61: v41.18,157.75 60.23,157.75 61.5,159.02 U1.5
  Bottom 1.016: Q1.G R14.1
LAYER_1
  Bottom 1.016: Q8.D 13.24,104.41 13.24,113.3 LAYER_1_8.1 R29.2
LAYER_2
  Bottom 1.016: Q7.D 12.61,90.44 11.33,91.71 11.33,114.57 12.61,115.84 LAYER_1_8.2 R27.2
LAYER_3
  Bottom 1.016: Q6.D 10.7,77.74 9.43,79.01 9.43,115.84 11.97,118.38 LAYER_1_8.3 R25.2
LAYER_4
  Bottom 1.016: Q5.D 8.79,65.04 7.53,66.31 7.53,117.74 10.7,120.92 LAYER_1_8.4 R23.2
LAYER_5
  Top 1.016: Q4.D 13.24,52.34 11.97,53.61 11.97,122.19 13.24,123.46 LAYER_1_8.5
  Bottom 1.016: LAYER_1_8.5 R21.2
LAYER_6
  Top 1.016: Q3.D 11.33,39.64 10.06,40.91 10.06,123.46 12.61,126 LAYER_1_8.6
  Bottom 1.016: LAYER_1_8.6 R19.2
LAYER_7
  Top 1.016: Q2.D 9.43,26.94 8.16,28.21 8.16,125.36 11.97,128.54 LAYER_1_8.7
  Bottom 1.016: LAYER_1_8.7 R17.2
LAYER_8
  Top 1.016: Q1.D 7.53,14.24 6.26,15.51 6.26,126.63 11.33,131.08 LAYER_1_8.8
  Bottom 1.016: LAYER_1_8.8 R15.2
LE_1  (via drill 0.6)
  Top 0.61: v72.93,167.91 v85.63,167.91
  Bottom 0.61: v72.93,167.91 65.31,167.91 64.04,166.64 U1.4 64.04,160.29 62.77,157.75 62.77,152.67 64.04,150.13 U2.4 64.04,137.43 62.77,134.89 62.77,129.81 64.04,127.27 U3.4 64.04,114.57 62.77,112.03 62.77,106.95 64.04,104.41 U4.4 64.04,91.71 62.77,89.17 62.77,84.09 64.04,81.55 U5.4 64.04,68.85 62.77,66.31 62.77,61.23 64.04,58.69 U6.4 64.04,45.99 62.77,43.45 62.77,38.37 64.04,35.83 U7.4 | U14.3 93.25,160.29 v85.63,167.91
LE_2
  Bottom 0.61: U8.4 98.33,19.32 99.6,21.86 99.6,26.94 98.33,29.48 U9.4 98.33,42.18 99.6,44.72 99.6,49.8 98.33,52.34 U10.4 98.33,65.04 99.6,67.58 99.6,72.66 98.33,75.2 U11.4 98.33,87.9 99.6,90.44 99.6,95.52 98.33,98.06 U12.4 98.33,110.76 99.6,113.3 99.6,118.38 98.33,120.92 U13.4 98.33,132.35 102.14,136.16 102.14,139.97 103.41,141.24 103.41,148.86 104.68,150.13 U14.14
LE_IN
  Top 0.813: CONTROL.3 111.03,148.86 109.76,150.13 109.76,155.21 107.22,157.75 U14.17
  Bottom 0.61: U14.17 103.41,157.75 100.87,155.21 100.87,153.94 99.6,152.67 U14.6
N$1
  Bottom 0.61: U2.2 69.12,141.24 67.85,143.78 67.85,150.13 66.58,152.67 U1.22
N$2
  Bottom 0.813: U1.13 BLUE_1_8.1
N$3
  Bottom 0.813: U1.14 BLUE_1_8.2
N$4
  Bottom 0.813: U1.15 BLUE_1_8.3
N$5
  Bottom 0.813: U2.23 R2.2
N$6
  Bottom 0.61: U2.22 66.58,129.81 67.85,127.27 67.85,122.19 69.12,119.65 U3.2
N$7
  Bottom 0.813: U1.16 BLUE_1_8.4
N$8
  Bottom 0.813: U1.17 BLUE_1_8.5
N$9
  Bottom 0.813: U1.18 BLUE_1_8.6
N$10
  Bottom 0.813: U3.23 R3.2
N$11
  Bottom 0.61: U4.2 69.12,96.79 67.85,99.33 67.85,104.41 66.58,106.95 U3.22
N$12
  Bottom 0.813: U1.19 BLUE_1_8.7
N$13
  Bottom 0.813: U1.20 BLUE_1_8.8
N$14
  Bottom 0.813: U4.23 R4.2
N$15
  Bottom 0.813: BLUE_9_16.1 U2.5
N$16
  Bottom 0.813: BLUE_9_16.2 U2.6
N$17
  Bottom 0.813: BLUE_9_16.3 U2.7
N$18
  Bottom 0.813: U1.23 R1.2
N$19
  Bottom 0.813: BLUE_9_16.4 U2.8
N$20
  Bottom 0.813: BLUE_9_16.5 U2.9
N$21
  Bottom 0.813: U5.23 R5.2
N$22
  Bottom 0.61: U6.2 69.12,49.8 67.85,52.34 67.85,58.69 66.58,61.23 U5.22
N$23
  Bottom 0.813: BLUE_9_16.6 U2.10
N$24
  Bottom 0.813: BLUE_9_16.7 U2.11
N$25
  Bottom 0.813: U6.23 R6.2
N$26
  Bottom 0.61: U7.2 69.12,26.94 67.85,29.48 67.85,35.83 66.58,38.37 U6.22
N$27
  Bottom 0.813: BLUE_9_16.8 U2.12
N$28
  Bottom 0.813: U2.13 BLUE_17_24.1
N$29
  Bottom 0.813: U2.14 BLUE_17_24.2
N$30
  Bottom 0.813: U2.15 BLUE_17_24.3
N$31
  Bottom 0.813: R7.2 U7.23
N$32
  Bottom 0.61: U7.22 66.58,12.97 69.12,10.43 90.71,10.43 93.25,12.97 U8.2
N$33
  Bottom 0.813: U2.16 BLUE_17_24.4
N$34
  Bottom 0.813: U2.17 BLUE_17_24.5
N$35
  Bottom 0.813: R8.2 U8.23
N$36
  Bottom 0.813: U2.18 BLUE_17_24.6
N$37
  Bottom 0.813: U2.19 BLUE_17_24.7
N$38
  Bottom 0.813: U2.20 BLUE_17_24.8
N$39
  Bottom 0.813: BLUE_25_32.1 U3.5
N$40
  Bottom 0.813: BLUE_25_32.2 U3.6
N$41
  Bottom 0.61: R9.2 U9.23
N$42
  Bottom 0.61: U9.22 95.79,49.8 94.52,52.34 94.52,57.42 93.25,59.96 U10.2
N$43
  Bottom 0.813: U3.7 BLUE_25_32.3
N$44
  Bottom 0.813: U3.8 BLUE_25_32.4
N$45
  Bottom 0.813: R10.2 U10.23
N$46
  Bottom 0.61: U10.22 95.79,72.66 94.52,75.2 94.52,80.28 93.25,82.82 U11.2
N$47
  Bottom 0.813: U3.9 BLUE_25_32.5
N$48
  Bottom 0.813: U3.10 BLUE_25_32.6
N$49
  Bottom 0.813: BLUE_25_32.7 U3.11
N$50
  Bottom 0.813: BLUE_25_32.8 U3.12
N$51
  Bottom 0.813: U11.23 R11.2
N$52
  Bottom 0.61: U11.22 95.79,95.52 94.52,98.06 94.52,104.41 93.25,105.68 U12.2
N$53
  Bottom 0.813: U3.13 BLUE_33_40.1
N$54
  Bottom 0.813: U3.14 BLUE_33_40.2
N$55
  Bottom 0.813: R12.2 U12.23
N$56
  Bottom 0.813: U3.15 BLUE_33_40.3
N$57
  Bottom 0.813: U3.16 BLUE_33_40.4
N$58
  Bottom 0.813: U3.17 BLUE_33_40.5
N$59
  Bottom 0.813: U3.18 BLUE_33_40.6
N$60
  Bottom 0.813: U3.19 BLUE_33_40.7
N$61
  Bottom 0.813: U3.20 BLUE_33_40.8
N$62
  Bottom 0.813: R13.2 U13.23
N$63
  Bottom 0.813: BLUE_41_48.1 U4.5
N$64
  Bottom 0.813: BLUE_41_48.2 U4.6
N$65
  Bottom 0.813: BLUE_41_48.3 U4.7
N$66
  Bottom 0.813: BLUE_41_48.4 U4.8
N$67
  Bottom 0.813: BLUE_41_48.5 U4.9
N$68
  Bottom 0.813: BLUE_41_48.6 U4.10
N$69
  Bottom 0.813: BLUE_41_48.7 U4.11
N$70
  Bottom 0.813: BLUE_41_48.8 U4.12
N$71
  Bottom 0.813: U4.13 BLUE_49_56.1
N$72
  Bottom 0.813: U4.14 BLUE_49_56.2
N$73
  Bottom 0.813: U4.15 BLUE_49_56.3
N$74
  Bottom 0.813: U4.16 BLUE_49_56.4
N$75
  Bottom 0.813: U4.17 BLUE_49_56.5
N$76
  Bottom 0.813: U4.18 BLUE_49_56.6
N$77
  Bottom 0.813: U4.19 BLUE_49_56.7
N$78
  Bottom 0.813: U4.20 BLUE_49_56.8
N$79
  Bottom 0.813: BLUE_57_64.1 U5.5
N$80
  Bottom 0.813: BLUE_57_64.2 U5.6
N$81
  Bottom 0.813: BLUE_57_64.3 U5.7
N$82
  Bottom 0.813: BLUE_57_64.4 U5.8
N$83
  Bottom 0.813: BLUE_57_64.5 U5.9
N$84
  Bottom 0.813: BLUE_57_64.6 U5.10
N$85
  Bottom 0.813: BLUE_57_64.7 U5.11
N$86
  Bottom 0.813: U5.12 BLUE_57_64.8
N$87
  Bottom 0.813: GREEN_1_8.1 U5.13
N$88
  Bottom 0.813: GREEN_1_8.2 U5.14
N$89
  Bottom 0.813: GREEN_1_8.3 U5.15
N$90
  Bottom 0.813: GREEN_1_8.4 U5.16
N$91
  Bottom 0.813: GREEN_1_8.5 U5.17
N$92
  Bottom 0.813: GREEN_1_8.6 U5.18
N$93
  Bottom 0.813: GREEN_1_8.7 U5.19
N$94
  Bottom 0.813: GREEN_1_8.8 U5.20
N$95
  Bottom 0.813: GREEN_9_16.1 U6.5
N$96
  Bottom 0.813: GREEN_9_16.2 U6.6
N$97
  Bottom 0.813: GREEN_9_16.3 U6.7
N$98
  Bottom 0.813: GREEN_9_16.4 U6.8
N$99
  Bottom 0.813: GREEN_9_16.5 U6.9
N$100
  Bottom 0.813: GREEN_9_16.6 U6.10
N$101
  Bottom 0.813: GREEN_9_16.7 U6.11
N$102
  Bottom 0.813: GREEN_9_16.8 U6.12
N$103
  Bottom 0.813: U6.13 GREEN_17_24.1
N$104
  Bottom 0.813: U6.14 GREEN_17_24.2
N$105
  Bottom 0.813: U6.15 GREEN_17_24.3
N$106
  Bottom 0.813: U6.16 GREEN_17_24.4
N$107
  Bottom 0.813: U6.17 GREEN_17_24.5
N$108
  Bottom 0.813: U6.18 GREEN_17_24.6
N$109
  Bottom 0.813: U6.19 GREEN_17_24.7
N$110
  Bottom 0.813: U6.20 GREEN_17_24.8
N$111
  Bottom 0.813: U7.5 GREEN_25_32.1
N$112
  Bottom 0.813: GREEN_25_32.2 U7.6
N$113
  Bottom 0.813: U7.7 GREEN_25_32.3
N$114
  Bottom 0.813: GREEN_25_32.4 U7.8
N$115
  Bottom 0.813: GREEN_25_32.5 U7.9
N$116
  Bottom 0.813: GREEN_25_32.6 U7.10
N$117
  Bottom 0.813: GREEN_25_32.7 U7.11
N$118
  Bottom 0.813: GREEN_25_32.8 U7.12
N$119
  Bottom 0.813: GREEN_33_40.1 U7.13
N$120
  Bottom 0.813: U7.14 GREEN_33_40.2
N$121
  Bottom 0.813: U7.15 GREEN_33_40.3
N$122
  Bottom 0.813: U7.16 GREEN_33_40.4
N$123
  Bottom 0.813: U7.17 GREEN_33_40.5
N$124
  Bottom 0.813: U7.18 GREEN_33_40.6
N$125
  Bottom 0.813: U7.19 GREEN_33_40.7
N$126
  Bottom 0.813: U7.20 GREEN_33_40.8
N$127
  Bottom 0.813: U8.5 GREEN_41_48.1
N$128
  Bottom 0.813: U8.6 GREEN_41_48.2
N$129
  Bottom 0.813: U8.7 GREEN_41_48.3
N$130
  Bottom 0.813: U8.8 GREEN_41_48.4
N$131
  Bottom 0.813: U8.9 GREEN_41_48.5
N$132
  Bottom 0.813: U8.10 GREEN_41_48.6
N$133
  Bottom 0.813: U8.11 GREEN_41_48.7
N$134
  Bottom 0.813: U8.12 GREEN_41_48.8
N$135
  Bottom 0.813: GREEN_49_56.1 U8.13
N$136
  Bottom 0.813: GREEN_49_56.2 U8.14
N$137
  Bottom 0.813: GREEN_49_56.3 U8.15
N$138
  Bottom 0.813: GREEN_49_56.4 U8.16
N$139
  Bottom 0.813: GREEN_49_56.5 U8.17
N$140
  Bottom 0.813: GREEN_49_56.6 U8.18
N$141
  Bottom 0.813: GREEN_49_56.7 U8.19
N$142
  Bottom 0.813: U8.20 GREEN_49_56.8
N$143
  Bottom 0.813: U9.5 GREEN_57_64.1
N$144
  Bottom 0.813: U9.6 GREEN_57_64.2
N$145
  Bottom 0.813: U9.7 GREEN_57_64.3
N$146
  Bottom 0.813: U9.8 GREEN_57_64.4
N$147
  Bottom 0.813: U9.9 GREEN_57_64.5
N$148
  Bottom 0.813: U9.10 GREEN_57_64.6
N$149
  Bottom 0.813: U9.11 GREEN_57_64.7
N$150
  Bottom 0.813: U9.12 GREEN_57_64.8
N$151
  Bottom 0.813: RED_1_8.1 U9.13
N$152
  Bottom 0.813: RED_1_8.2 U9.14
N$153
  Bottom 0.813: RED_1_8.3 U9.15
N$154
  Bottom 0.813: RED_1_8.4 U9.16
N$155
  Bottom 0.813: RED_1_8.5 U9.17
N$156
  Bottom 0.813: RED_1_8.6 U9.18
N$157
  Bottom 0.813: RED_1_8.7 U9.19
N$158
  Bottom 0.813: RED_1_8.8 U9.20
N$159
  Bottom 0.813: U10.5 RED_9_16.1
N$160
  Bottom 0.813: U10.6 RED_9_16.2
N$161
  Bottom 0.813: U10.7 RED_9_16.3
N$162
  Bottom 0.813: U10.8 RED_9_16.4
N$163
  Bottom 0.813: U10.9 RED_9_16.5
N$164
  Bottom 0.813: U10.10 RED_9_16.6
N$165
  Bottom 0.813: U10.11 RED_9_16.7
N$166
  Bottom 0.813: U10.12 RED_9_16.8
N$167
  Bottom 0.813: RED_17_24.1 U10.13
N$168
  Bottom 0.813: RED_17_24.2 U10.14
N$169
  Bottom 0.813: RED_17_24.3 U10.15
N$170
  Bottom 0.813: RED_17_24.4 U10.16
N$171
  Bottom 0.813: RED_17_24.5 U10.17
N$172
  Bottom 0.813: RED_17_24.6 U10.18
N$173
  Bottom 0.813: RED_17_24.7 U10.19
N$174
  Bottom 0.813: RED_17_24.8 U10.20
N$175
  Bottom 0.813: U11.5 RED_25_32.1
N$176
  Bottom 0.813: U11.6 RED_25_32.2
N$177
  Bottom 0.813: U11.7 RED_25_32.3
N$178
  Bottom 0.813: U11.8 RED_25_32.4
N$179
  Bottom 0.813: U11.9 RED_25_32.5
N$180
  Bottom 0.813: U11.10 RED_25_32.6
N$181
  Bottom 0.813: U11.11 RED_25_32.7
N$182
  Bottom 0.813: U11.12 RED_25_32.8
N$183
  Bottom 0.813: RED_33_40.1 U11.13
N$184
  Bottom 0.813: RED_33_40.2 U11.14
N$185
  Bottom 0.813: RED_33_40.3 U11.15
N$186
  Bottom 0.813: RED_33_40.4 U11.16
N$187
  Bottom 0.813: RED_33_40.5 U11.17
N$188
  Bottom 0.813: RED_33_40.6 U11.18
N$189
  Bottom 0.813: RED_33_40.7 U11.19
N$190
  Bottom 0.813: RED_33_40.8 U11.20
N$191
  Bottom 0.813: U12.5 RED_41_48.1
N$192
  Bottom 0.813: U12.6 RED_41_48.2
N$193
  Bottom 0.813: U12.7 RED_41_48.3
N$194
  Bottom 0.813: U12.8 RED_41_48.4
N$195
  Bottom 0.813: U12.9 RED_41_48.5
N$196
  Bottom 0.813: U12.10 RED_41_48.6
N$197
  Bottom 0.813: U12.11 RED_41_48.7
N$198
  Bottom 0.813: U12.12 RED_41_48.8
N$199
  Bottom 0.813: RED_49_56.1 U12.13
N$200
  Bottom 0.813: RED_49_56.2 U12.14
N$201
  Bottom 0.813: RED_49_56.3 U12.15
N$202
  Bottom 0.813: RED_49_56.4 U12.16
N$203
  Bottom 0.813: RED_49_56.5 U12.17
N$204
  Bottom 0.813: RED_49_56.6 U12.18
N$205
  Bottom 0.813: RED_49_56.7 U12.19
N$206
  Bottom 0.813: RED_49_56.8 U12.20
N$207
  Bottom 0.813: U13.5 RED_57_64.1
N$208
  Bottom 0.813: U13.6 RED_57_64.2
N$209
  Bottom 0.813: U13.7 RED_57_64.3
N$210
  Bottom 0.813: U13.8 RED_57_64.4
N$211
  Bottom 0.813: U13.9 RED_57_64.5
N$212
  Bottom 0.813: U13.10 RED_57_64.6
N$213
  Bottom 0.813: U13.11 RED_57_64.7
N$214
  Bottom 0.813: U13.12 RED_57_64.8
N$215
  pour Bottom (isolate 0.61): 2.27,176.27 2.27,2.27 125.27,2.27 125.27,176.27
N$216
  pour Top (isolate 0.61): 2.27,176.27 2.27,2.27 125.27,2.27 125.27,176.27
N$217  (via drill 2.8)
  other vias: 6.27,172.27
N$218  (via drill 2.8)
  other vias: 121.27,172.27
N$219  (via drill 2.8)
  other vias: 121.27,6.27
N$220  (via drill 2.8)
  other vias: 6.27,6.27
OE
  Bottom 0.61: CONTROL.4 111.03,151.4 108.49,153.94 103.41,153.94 102.14,152.67 102.14,142.51 U13.21 98.33,134.89 97.06,133.62 97.06,120.92 98.33,118.38 U12.21 98.33,113.3 97.06,110.76 97.06,98.06 98.33,95.52 U11.21 98.33,90.44 97.06,87.9 97.06,75.2 98.33,72.66 U10.21 98.33,67.58 97.06,65.04 97.06,52.34 98.33,49.8 U9.21 98.33,44.72 97.06,42.18 97.06,29.48 98.33,26.94 U8.21 98.33,21.86 97.06,19.32 97.06,14.24 92.17,9.35 arc-45 91.72,9.16 67.85,9.16 64.23,12.78 arc-45 64.04,13.23 U7.21 64.04,20.59 65.31,23.13 65.31,35.83 64.04,38.37 U6.21 64.04,43.45 65.31,45.99 65.31,58.69 64.04,61.23 U5.21 64.04,66.31 65.31,68.85 65.31,81.55 64.04,84.09 U4.21 64.04,89.17 65.31,91.71 65.31,104.41 64.04,106.95 U3.21 64.04,112.03 65.31,114.57 65.31,127.27 64.04,129.81 U2.21 64.04,134.89 65.31,137.43 65.31,150.13 64.04,152.67 U1.21
SDI_IN
  Bottom 0.813: CONTROL.1 109.76,143.78 108.49,145.05 108.49,146.32 107.22,147.59 U14.13
U1_SDI  (via drill 0.6)
  Top 0.61: v75.47,165.37 v83.09,165.37
  Bottom 0.61: U1.2 69.12,164.1 70.39,165.37 v75.47,165.37 | U14.7 97.06,150.13 95.79,151.4 95.79,152.67 v83.09,165.37
U5_SDI
  Bottom 0.61: U5.2 69.12,72.66 67.85,75.2 67.85,81.55 66.58,84.09 U4.22
U9_SDI
  Bottom 0.61: U8.22 95.79,26.94 94.52,29.48 94.52,34.56 93.25,37.1 U9.2
U13_SDI
  Bottom 0.61: U12.22 95.79,118.38 94.52,120.92 94.52,127.27 93.25,128.54 U13.2

### Text on the board
tNames: Power Source : 5V DC 5000mA | GND / +5V | BOI | +5V / +5V / GND / GND / OE / LE / CLK / SDI | 8*8*8 RGB LED CUBE | Designed By Siew.G.C / Copyright © All Rights Reserved | WARNING ! | Only use this item if you are confident with your eletronic knowledge, improper operation of this item may cause burn or electric shock and damage to property. / Siew.G.C shall not be held responsible for any personal injury, risk of electric shock and damage to property that may result from the use of this product. | 4 Apr 2014 V 1.0 | RGB LED CUBE DRIVER BOARD